# EAGLE design Pluvion 1 - Rev A (EAGLE 7.3.0)

## Sheet 1 of 3
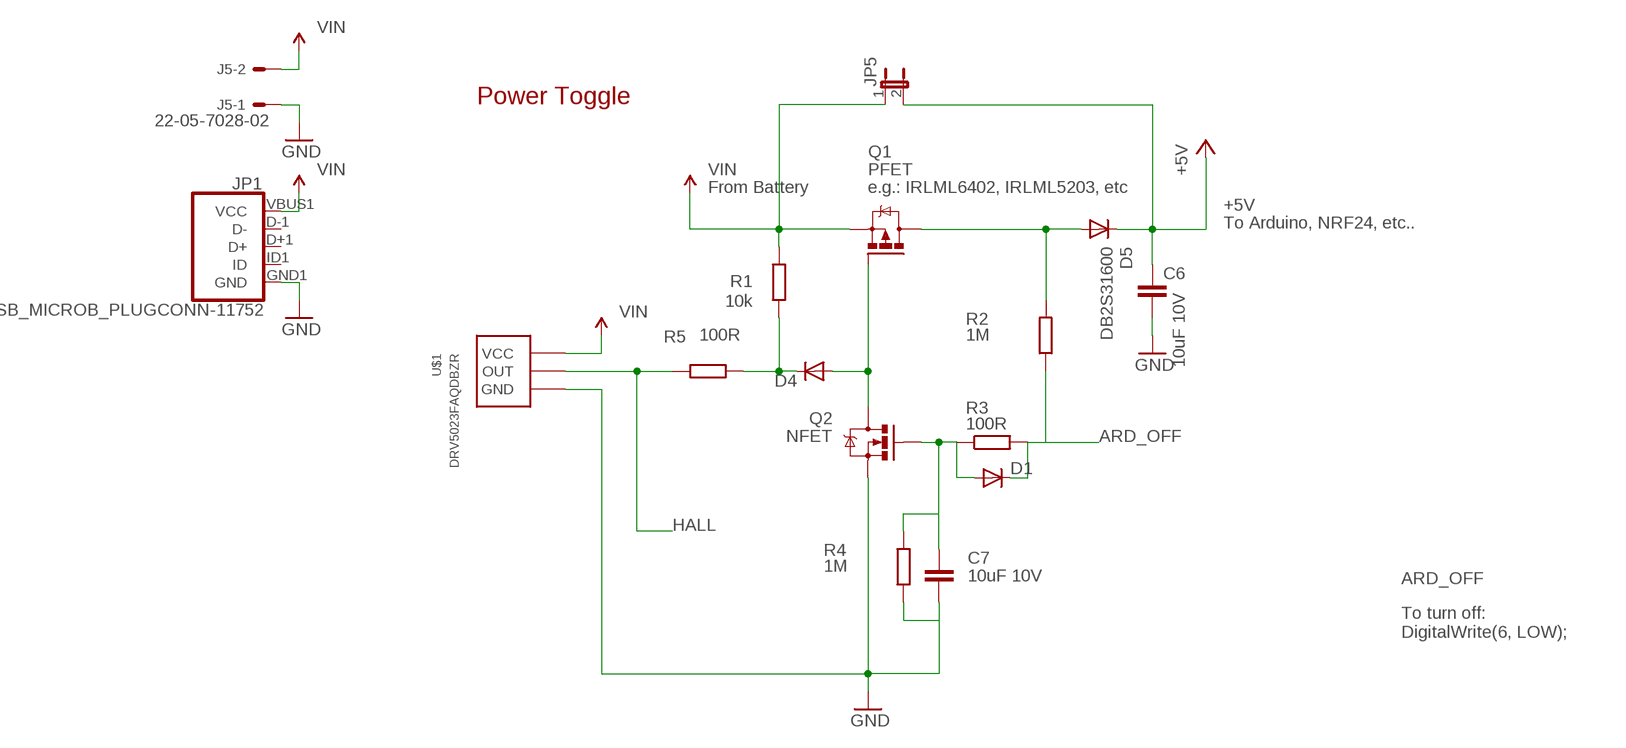
[diagram p0: schematic, sheet 1]

### Parts
C6  10uF 10V  C-EUC0805  [C0805]
C7  10uF 10V  C-EUC0805  [C0805]
D1  DIODESOD  [SOD-323]
D4  DIODESOD  [SOD-323]
D5  DB2S31600  DIODESMA  [SMA-DIODE]
J5  22-05-7028-02  [7395-02]
JP1  USB_MICROB_PLUGCONN-11752  [USB-B-MICRO-SMD_V03]
JP5  JUMPER-2PTH  [1X02]
Q1  PFET  IRLML5203  [MICRO3]
Q2  NFET  MOSFET-NCHANNELBSS123LT1G  [SOT23]
R1  10k  R-EU_R0805  [R0805]
R2  1M  R-EU_R0805  [R0805]
R3  100R  R-EU_R0805  [R0805]
R4  1M  R-EU_R0805  [R0805]
R5  100R  R-EU_R0805  [R0805]
U$1  DRV5023FAQDBZR  [SOT23]

### Nets
+5V: C6.1 D5.C JP5.2 ; also sheet 2
ARD_OFF: D1.1(C) R2.1 R3.2
BUTTONS: D4.2(A) Q1.1(G) Q2.3(D)
GND: C6.2 C7.2 J5.1 JP1.GND1(GND) Q2.2(S) R4.1 U$1.3(GND) ; also sheet 2,3
HALL: R5.2 U$1.2(OUT) ; also sheet 3
N$1: D5.A Q1.3(D) R2.2
N$2: C7.1 D1.2(A) Q2.1(G) R3.1 R4.2
N$8: D4.1(C) R1.1 R5.1
VIN: J5.2 JP1.VBUS1(VCC) JP5.1 Q1.2(S) R1.2 U$1.1(VCC)
Unconnected: JP1.D+1(D+) JP1.D-1(D-) JP1.ID1(ID)

### Notes on the sheet
- Power Toggle
- From Battery | e.g.: IRLML6402, IRLML5203, etc
- To Arduino, NRF24, etc..
- To turn off:
  DigitalWrite(6, LOW);

## Sheet 2 of 3
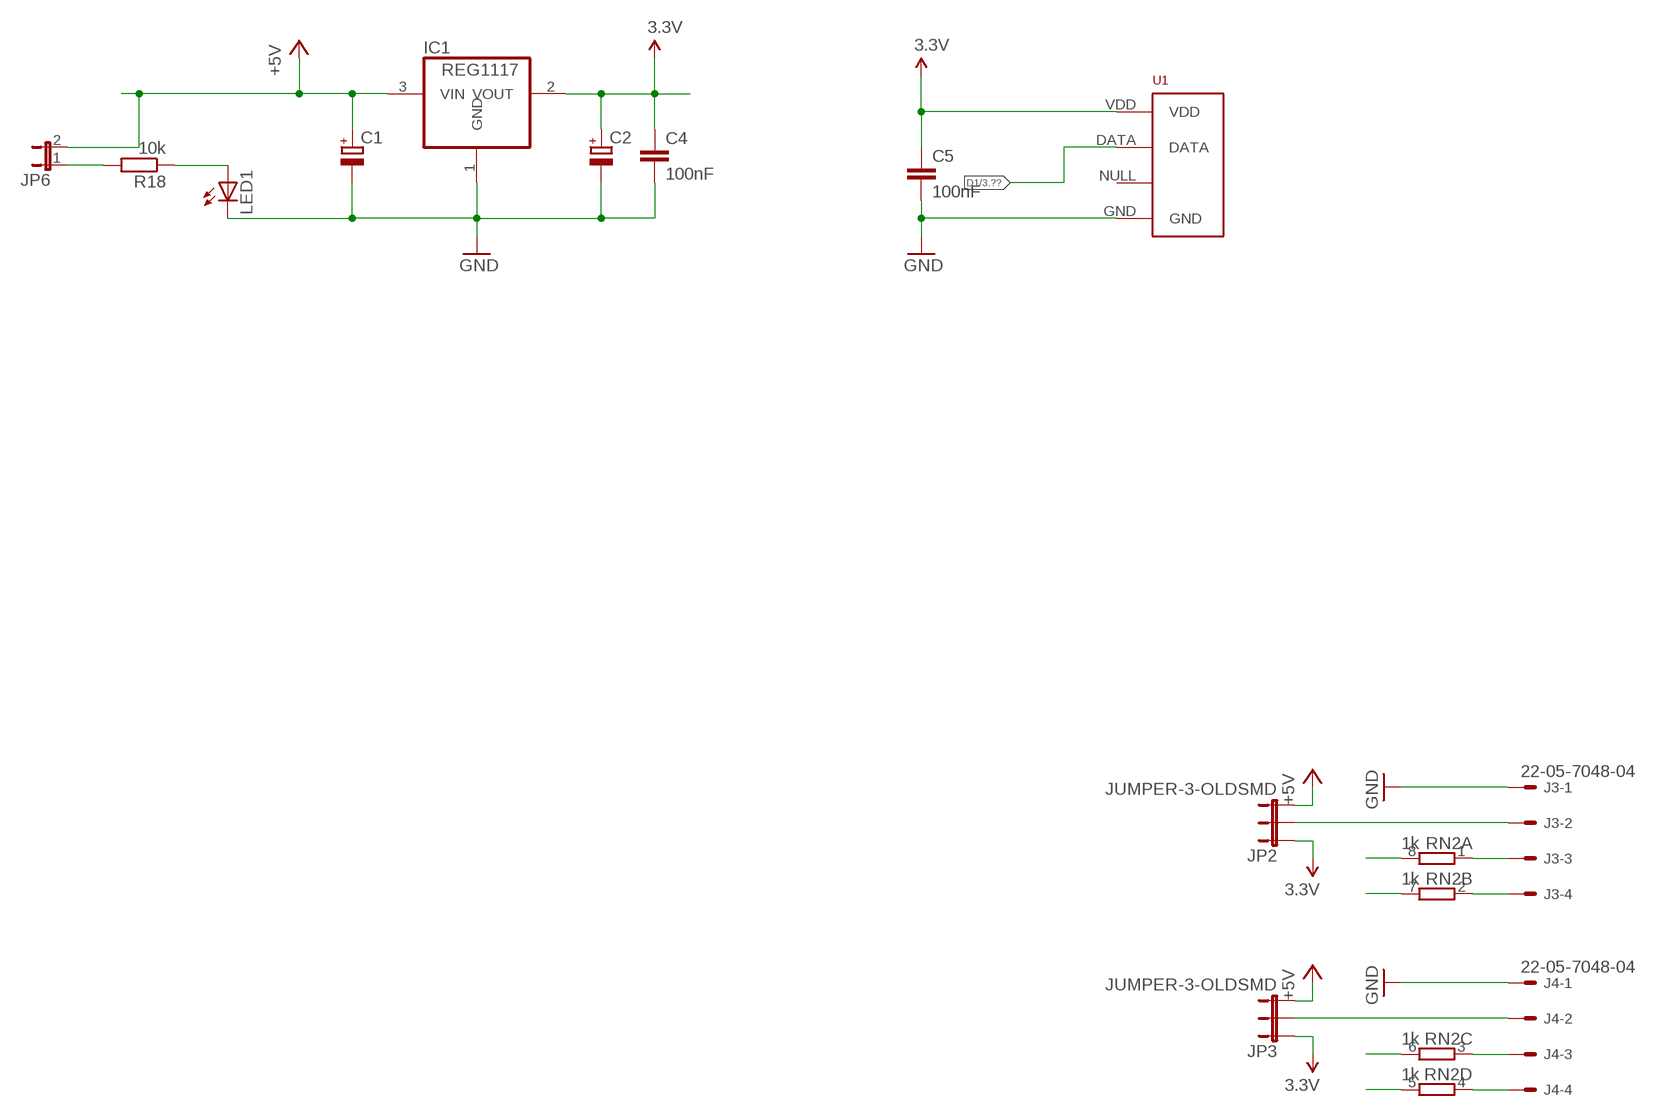
[diagram p1: schematic, sheet 2]

### Parts
C1  CPOL-EUC  [PANASONIC_C]
C2  CPOL-EUC  [PANASONIC_C]
C4  100nF  C-EUC0805  [C0805]
C5  100nF  C-EUC0805  [C0805]
IC1  REG1117  [SOT223]
J3  22-05-7048-04  [7395-04]
J4  22-05-7048-04  [7395-04]
JP2  JUMPER-3-OLDSMD  [SJ_3]
JP3  JUMPER-3-OLDSMD  [SJ_3]
JP6  JUMPER-2SMD-NO  [SJ_2S-NO]
LED1  LED1206  [LED-1206]
R18  10k  R-EU_R0805  [R0805]
RN2  1k  4R-N0603-ARV  [0603-ARV]
U1  RHT03_DHT-22_AM2302RA  [RHT03_DHT-22/RA]

### Nets
+3V3: C2.+ C4.1 C5.1 IC1.2(VOUT) JP2.1 JP3.1 U1.VDD ; supply symbol labelled 3.3V ; also sheet 3
+5V: C1.+ IC1.3(VIN) JP2.3 JP3.3 JP6.2 ; also sheet 1
D1: U1.DATA ; also sheet 3
GND: C1.- C2.- C4.2 C5.2 IC1.1(GND) J3.1 J4.1 LED1.C U1.GND ; also sheet 1,3
N$3: J3.3 RN2.1
N$4: J3.4 RN2.2
N$9: RN2.8
N$16: RN2.7
N$17: J4.3 RN2.3
N$18: J3.2 JP2.2
N$19: J4.4 RN2.4
N$20: J4.2 JP3.2
N$21: RN2.6
N$22: RN2.5
N$33: LED1.A R18.1
N$34: JP6.1 R18.2
Unconnected: U1.NULL

## Sheet 3 of 3
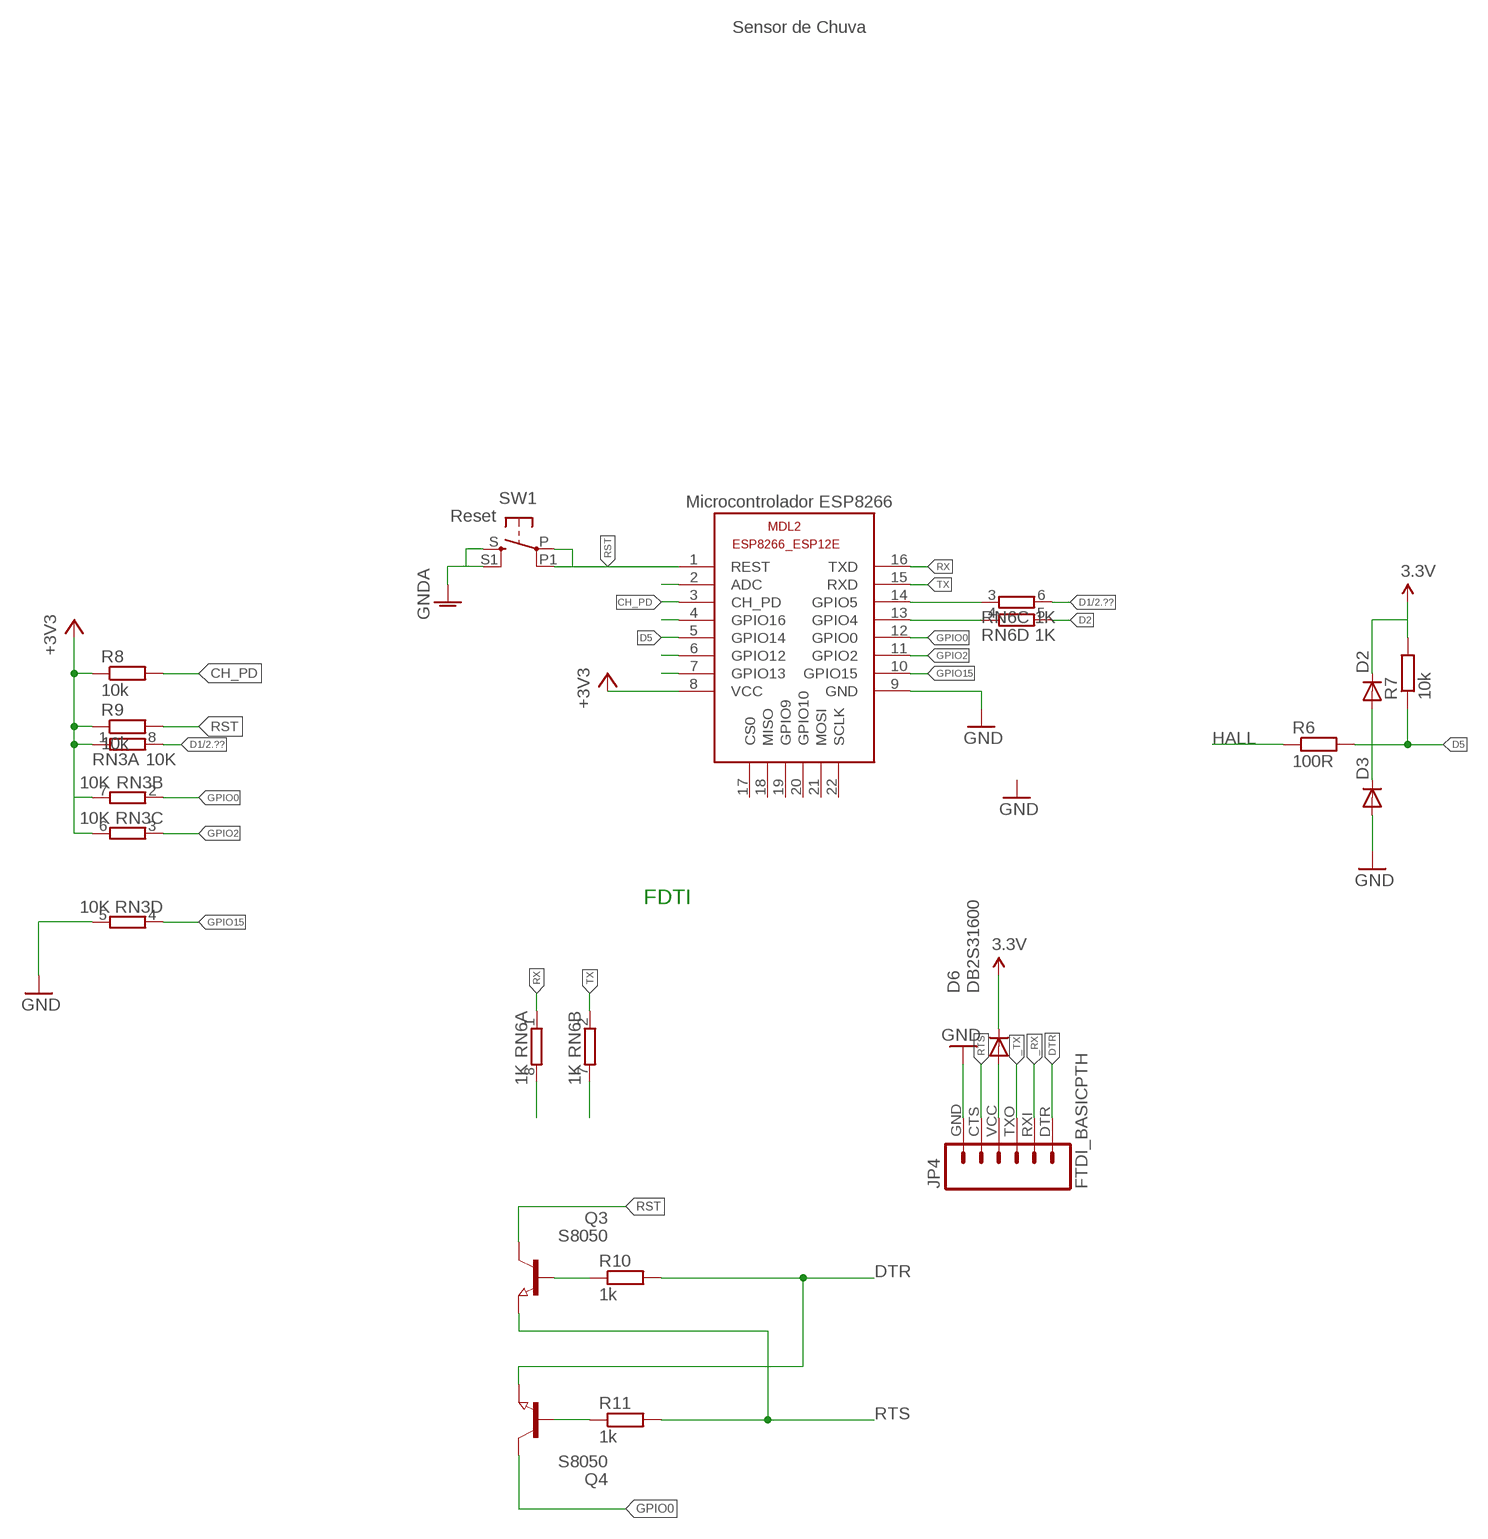
[diagram p2: schematic, sheet 3]

### Parts
D2  DIODESOD  [SOD-323]
D3  DIODESOD  [SOD-323]
D6  DB2S31600  DIODESMA  [SMA-DIODE]
JP4  FTDI_BASICPTH  [FTDI_BASIC]
MDL2  ESP8266-12EESP8266-ESP12E  [ESP8266-ESP12E]
Q3  S8050  NPN-TRANSISTOR_SOT23  [SOT23]
Q4  S8050  NPN-TRANSISTOR_SOT23  [SOT23]
R6  100R  R-EU_R0805  [R0805]
R7  10k  R-EU_R0805  [R0805]
R8  10k  R-EU_R0805  [R0805]
R9  10k  R-EU_R0805  [R0805]
R10  1k  R-EU_R0805  [R0805]
R11  1k  R-EU_R0805  [R0805]
RN3  10K  4R-N0603-ARV  [0603-ARV]
RN6  1K  4R-N0603-ARV  [0603-ARV]
SW1  Reset  10-XX-4.5SMD  [BT4.5X4.5]

### Nets
+3V3: D2.1(C) D6.C MDL2.8(VCC) R7.2 R8.1 R9.1 RN3.1 RN3.6 RN3.7 ; supply symbol labelled 3.3V ; also sheet 2
_RX: JP4.RXI RN6.8
_TX: JP4.TXO RN6.7
CH_PD: MDL2.3(CH_PD) R8.2
D1: RN3.8 RN6.6 ; also sheet 2
D2: RN6.5
D5: D2.2(A) D3.1(C) MDL2.5(GPIO14) R6.2 R7.1
DTR: JP4.DTR Q4.2(E) R10.2
GND: D3.2(A) JP4.GND MDL2.9(GND) RN3.5 SW1.S SW1.S1 ; supply symbol labelled GNDA ; also sheet 1,2
GPIO0: MDL2.12(GPIO0) Q4.3(C) RN3.2
GPIO2: MDL2.11(GPIO2) RN3.3
GPIO15: MDL2.10(GPIO15) RN3.4
HALL: R6.1 ; also sheet 1
N$6: Q3.1(B) R10.1
N$7: Q4.1(B) R11.1
N$10: MDL2.7(GPIO13)
N$11: MDL2.4(GPIO16)
N$12: MDL2.6(GPIO12)
N$14: MDL2.2(ADC)
N$25: MDL2.14(GPIO5) RN6.3
N$27: D6.A JP4.VCC
N$30: MDL2.13(GPIO4) RN6.4
RST: MDL2.1(REST) Q3.3(C) R9.2 SW1.P SW1.P1
RTS: JP4.CTS Q3.2(E) R11.2
RX: MDL2.16(TXD) RN6.1
TX: MDL2.15(RXD) RN6.2
Unconnected: MDL2.17(CS0) MDL2.18(MISO) MDL2.19(GPIO9) MDL2.20(GPIO10) MDL2.21(MOSI) MDL2.22(SCLK)

### Notes on the sheet
- Sensor de Chuva
- Microcontrolador ESP8266
- FDTI

## Library data of the parts
C1 C2 = wes:CPOL-EU: POLARIZED CAPACITOR, European symbol
C4-C7 = wes:C-EU: CAPACITOR, European symbol
D1-D4 = SparkFun-DiscreteSemi:DIODE: Diode These are standard reverse protection diodes and small signal diodes. SMA package can handle up to about 1A. SOD-323 can handle about 200mA. What the SOD-323 package when ordering, there are some mfgs out there that are 5-pin packages.; PROD_ID: DIO-09646
D5 D6 = SparkFun-DiscreteSemi:DIODE: Diode These are standard reverse protection diodes and small signal diodes. SMA package can handle up to about 1A. SOD-323 can handle about 200mA. What the SOD-323 package when ordering, there are some mfgs out there that are 5-pin packages.
IC1 = burr-brown:REG1117: 800mA and 1A Low Dropout (LDO) Positive Regulator 1.8V, 2.5V, 2.85V, 3.3V, 5V, and Adj; MPN: REG1117; OC_FARNELL: 1097566; OC_NEWARK: 14P6981
J3 J4 = con-molex:22-?-04: CONNECTOR wire to board 2.54 mm (.1 inch) pitch header; OC_FARNELL: unknown; OC_NEWARK: unknown
J5 = con-molex:22-?-02: CONNECTOR wire to board 2.54 mm (.1 inch) pitch header; OC_FARNELL: 9731601; OC_NEWARK: unknown
JP1 = SparkFun-Connectors:USB_MICROB_PLUG: USB Micro-B Plug Comes in a variety of packages. Check out Hirose's ZX-x0 line: http://www.hirose.co.jp/cataloge_hp/e24200011.pdf; PROD_ID: CONN-11752
JP2 JP3 = SparkFun-Passives:JUMPER-3-OLD
JP4 = SparkFun-Connectors:FTDI_BASIC: FTDI Basic header with labels
JP5 JP6 = SparkFun-Passives:JUMPER-2: Jumper Basic 0.1" spaced jumper. Use with breakaway headers.
LED1 = SparkFun-LED:LED: LEDs Standard schematic elements and footprints for 5mm, 3mm, 1206, and 0603 sized LEDs. 5mm - Spark Fun Electronics SKU : COM-00529 (and others)
MDL2 = ESP8266-ESP12E:ESP8266-12E: ESP8266-12E with additional I/O and GPIO04/05 corrected The author cannot warrant that this library is free from error or will meet your specific requirements. Created by PuceBaboon.com. Komagane, Nagano, JAPAN
Q1 = transistor-power:IRLML5203: HEXFET P-Channel Power MOSFET
Q2 = SparkFun-DiscreteSemi:MOSFET-NCHANNEL: Common NMOSFET Parts MFG P/N Store ID Prod ID FDD8780 TRANS-09984 SI7820DN TRANS-11055 FDS6630A IC-08089 2N7002PW TRANS-11151 FQP30N06L COM-10213 TRANS-10060 BSS123LT1G TRANS-08345 BSS138 TRANS-00830 BS170 2N7000; PROD_ID: TRANS-08345
Q3 Q4 = semicon-smd-ipc:NPN-TRANSISTOR_: NPN TRANSISTOR
R1-R11 R18 = wes:R-EU_: RESISTOR, European symbol
RN2 RN3 RN6 = resistor-dil:4R-N: Array Chip Resistor Source: RS Component / Phycomp; OC_FARNELL: unknown; OC_NEWARK: unknown
SW1 = buttons:10-XX: OMRON SWITCH
U1 = RHT03_DHT-22_AM2302:RHT03_DHT-22_AM2302: RHT03 / DHT-22 / AM2302 Packages and symbol for the RHT03 / DHT-22 relative humidity and temperature sensor. Note: The AM2302 is a wired version of the DHT-22 which typically requires less clearance and is thus provided as a separate package.; PROD_ID: SEN-10167
U$1 = lib_pluvion:DRV5023FAQDBZR: Digital Switch Hall Sensor

## Board
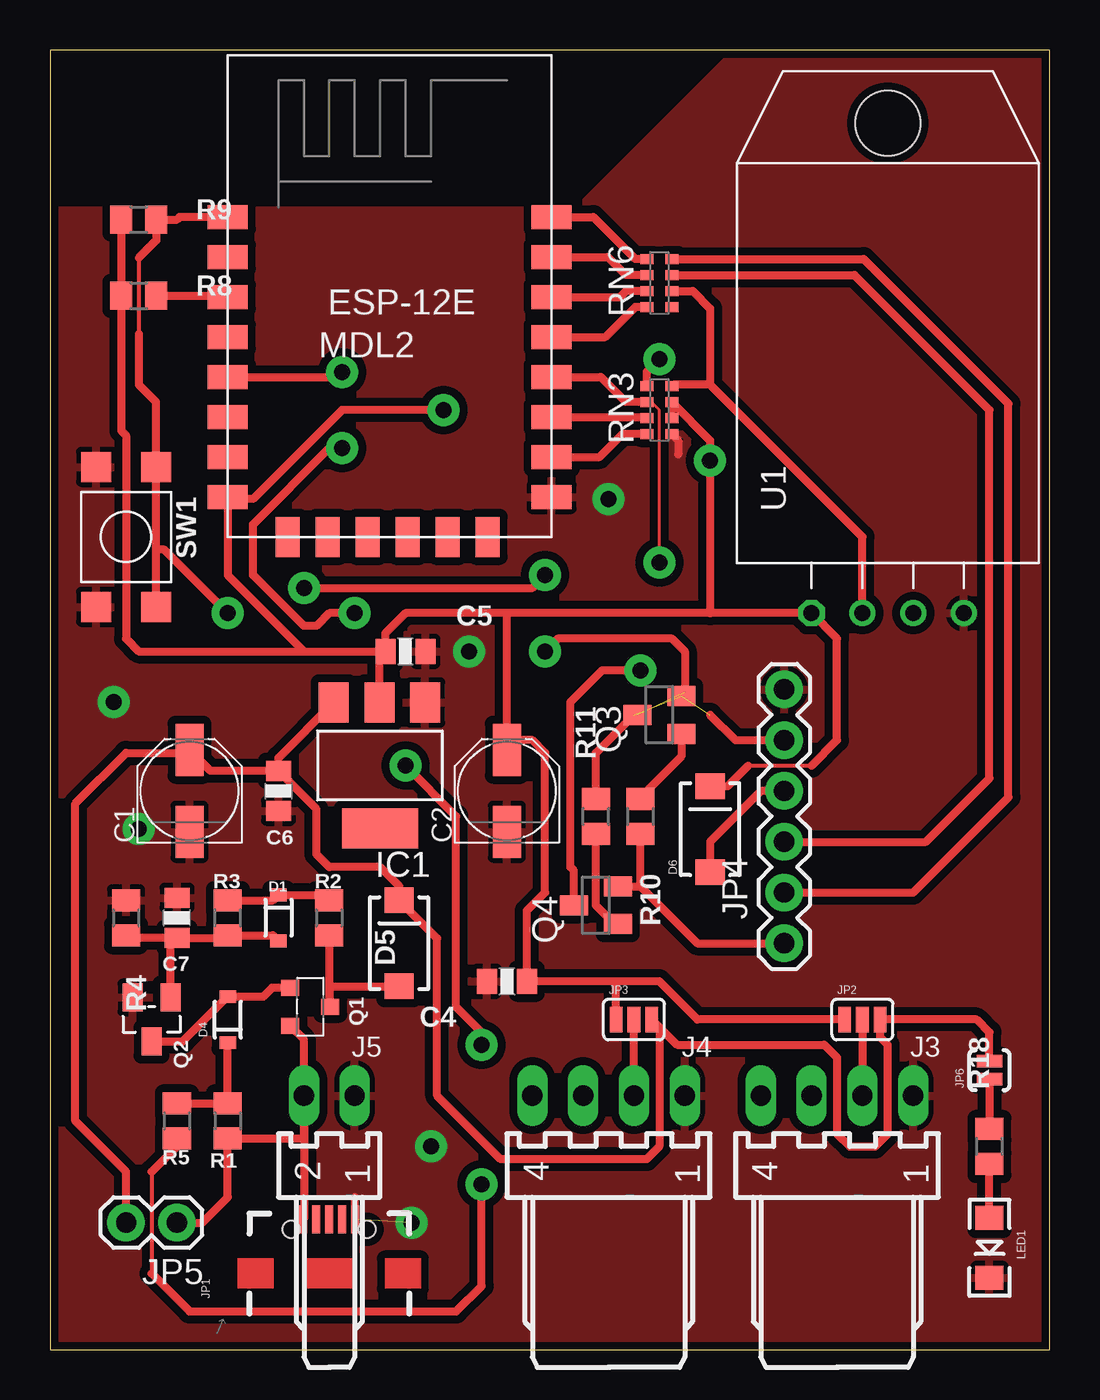
[diagram p3: board, top side]
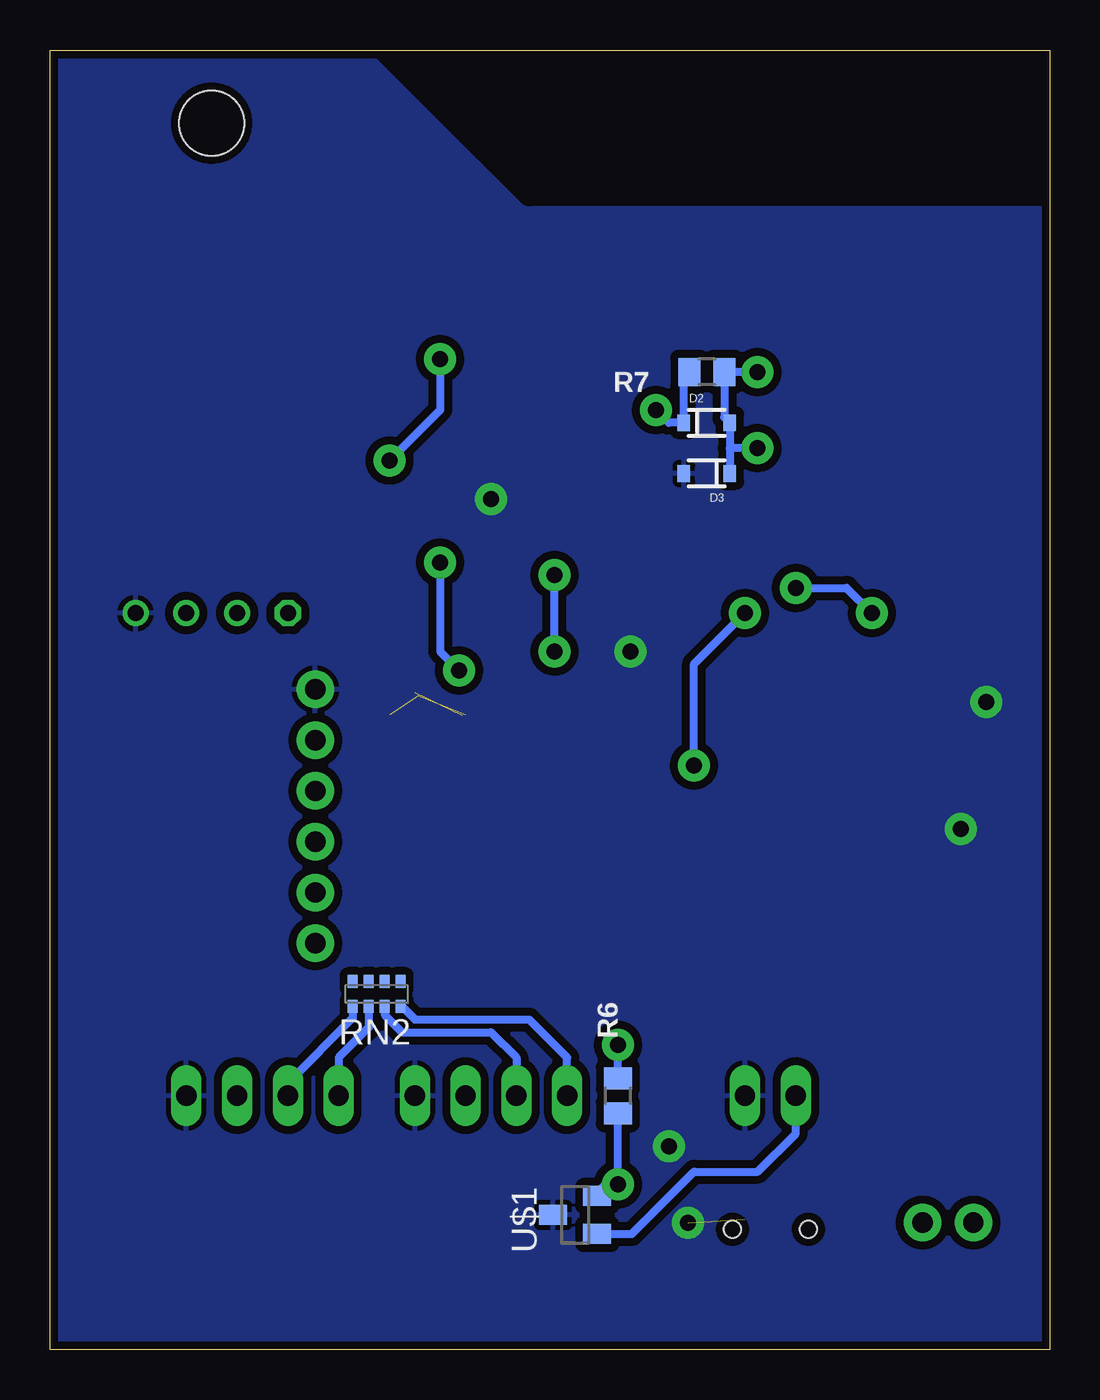
[diagram p4: board, bottom side, seen from below]

Size 50 x 65 mm. Coordinates in mm from the lower left corner, seen from the top.
Outline: 0,0 50,0 50,65 0,65 0,0
Copper layers (1*16): Top 0.035mm / dielectric 1.5mm / Bottom 0.035mm
Design rules "default *": minimum track width 10mil, minimum drill 0.6mm, track to track 8mil, track to pad 8mil, pad to pad 8mil, via to via 8mil, smd to smd 8mil, copper to edge 10mil, drill to drill 8mil, minimum pad ring 10mil, minimum via ring 8mil, stop-mask expansion 4mil, vias tented up to drill 0mil, thermal gap 10mil
tRestrict: area -1.3,57.8 to 34.3,66
bRestrict: area -1.3,57.8 to 34.3,66

### Footprints (pad centres in the part's own frame; a part is rotated, then mirrored left to right if it is on the bottom)
PANASONIC_C = smd 2.6 x 1.4: + 2.05,0; - -2.05,0
C0805 = smd 1 x 1.25: 1 -1,0; 2 1,0
SOD-323 = smd 0.63 x 0.83: 1 -1.15,0; 2 1.15,0
SMA-DIODE = smd 1.27 x 1.47: A -2.15,0; C 2.15,0
SOT223 = smd 1.499 x 2.007: 1 -2.261,-3.15; 2 0.025,-3.15; 3 2.311,-3.15 | smd 3.81 x 2.007: 4 0,3.15
7395-04 = drill 1.016 long: 1 3.81,0; 2 1.27,0; 3 -1.27,0; 4 -3.81,0
7395-02 = drill 1.016 long: 1 1.27,0; 2 -1.27,0
USB-B-MICRO-SMD_V03 = smd 1.4 x 0.4: D+1 2.7,0; D-1 2.7,0.65; GND1 2.7,-1.3; ID1 2.7,-0.65; VBUS1 2.7,1.3 | hole 0.85: 2.2,1.9; 2.2,-1.9
SJ_3 = smd 0.635 x 1.27: 1 -0.889,0; 2 0,0; 3 0.889,0
FTDI_BASIC = drill 1.016 pad 1.88: CTS 10.16,0; DTR 0,0; GND 12.7,0; RXI 2.54,0; TXO 5.08,0; VCC 7.62,0
1X02 = drill 1.016 pad 1.88: 1 0,0; 2 2.54,0
SJ_2S-NO = smd 0.635 x 1.27: 1 -0.45,0; 2 0.45,0
LED-1206 = smd 1.2 x 1.4: A -1.5,0; C 1.5,0
ESP8266-ESP12E = smd 2 x 1.2: 1 -7.62,5.84; 2 -7.62,3.84; 3 -7.62,1.84; 4 -7.62,-0.16; 5 -7.62,-2.16; 6 -7.62,-4.16; 7 -7.62,-6.16; 8 -7.62,-8.16; 9 8.58,-8.16; 10 8.58,-6.16; 11 8.58,-4.16; 12 8.58,-2.16; 13 8.58,-0.16; 14 8.58,1.84; 15 8.58,3.84; 16 8.58,5.84 | smd 1.2 x 2: 17 -4.62,-10.16; 18 -2.62,-10.16; 19 -0.62,-10.16; 20 1.38,-10.16; 21 3.38,-10.16; 22 5.38,-10.16
MICRO3 = smd 0.8 x 0.9: 1 -0.95,-1; 2 0.95,-1; 3 0,1
SOT23 = smd 1 x 1.4: 1 -0.95,-1.1; 2 0.95,-1.1; 3 0,1.1
R0805 = smd 1.1 x 1.4: 1 -0.875,0; 2 0.875,0
0603-ARV = smd 0.5 x 0.65: 1 -1.2,-0.625; 2 -0.4,-0.625; 3 0.4,-0.625; 4 1.2,-0.625; 5 1.2,0.625; 6 0.4,0.625; 7 -0.4,0.625; 8 -1.2,0.625
BT4.5X4.5 = smd 1.5 x 1.5: P -3.5,1.5; P1 3.5,1.5; S -3.5,-1.5; S1 3.5,-1.5
RHT03_DHT-22/RA = drill 0.8: DATA -1.27,0; GND 3.81,0; NULL 1.27,0 | drill 0.8 octagon: VDD -3.81,0 | hole 3.25: 0,24.5

### Placement (x,y rotation side)
C1  6.99,27.94 90 top
C2  22.86,27.94 90 top
C4  22.86,18.41 180 top
C5  17.78,34.92 0 top
C6  11.43,27.94 270 top
C7  6.35,21.59 90 top
D1  11.43,21.59 270 top
D2  17.14,46.35 0 bottom
D3  17.14,43.81 180 bottom
D4  8.89,16.51 90 top
D5  17.46,20.32 90 top
D6  33.02,26.04 90 top
IC1  16.51,29.21 180 top
J3  39.37,12.7 0 top
J4  27.94,12.7 0 top
J5  13.97,12.7 0 top
JP1  13.97,3.81 90 top
JP2  40.64,16.51 0 top
JP3  29.21,16.51 0 top
JP4  36.73,20.32 90 top
JP5  6.35,6.35 180 top
JP6  46.99,13.97 90 top
LED1  46.99,5.08 270 top
MDL2  16.51,50.8 0 top
Q1  13.02,17.14 270 top
Q2  5.08,16.51 180 top
Q3  30.48,31.75 90 top
Q4  27.3,22.23 90 top
R1  8.89,11.43 270 top
R2  13.97,21.59 270 top
R3  8.89,21.59 90 top
R4  3.81,21.59 270 top
R5  6.35,11.43 270 top
R6  21.59,12.7 90 bottom
R7  17.14,48.9 180 bottom
R8  4.45,52.7 0 top
R9  4.45,56.52 0 top
R10  29.53,26.67 270 top
R11  27.3,26.67 90 top
R18  46.99,10.16 90 top
RN2  33.66,17.78 0 bottom
RN3  30.48,46.99 270 top
RN6  30.48,53.34 270 top
SW1  3.81,40.64 270 top
U1  41.91,36.83 0 top
U$1  23.73,6.73 90 bottom

### Tracks (layer width: path | path; a pad name or v marks a point on that pad's centre or on a via)
+3V3  (via drill 0.8 pad 1.6)
  Top 0.203: 34.92,29.21 38.1,29.21
  Top 0.406: RN3.6 RN3.7 33.02,45.48 v33.02,44.45 33.02,36.83 | IC1.2 16.48,34.63 C5.1 | C5.1 16.78,35.83 17.78,36.83 22.86,36.83 | 12.7,34.92 8.89,38.73 MDL2.8 8.98,42.55 10.16,42.55 14.61,46.99 v19.68,46.99 | 12.7,34.92 C5.1 | 33.02,36.83 U1.VDD 39.37,35.56 39.37,30.48 38.1,29.21 | 33.02,36.83 22.86,36.83 | 22.86,36.83 C2.+ 23,30.48 24.13,30.48 24.77,29.84 24.77,22.86 23.86,21.95 C4.1 28.32,18.41 | RN3.1 29.86,48.91 v30.48,49.53 | JP2.1 32.38,16.51 30.48,18.41 28.32,18.41 | JP3.1 28.32,18.41 | D6.C 33.9,28.18 34.92,29.21 | R9.1 R8.1 3.57,45.96 3.81,45.72 3.81,35.56 4.45,34.92 12.7,34.92
  Bottom 0.406: v30.48,49.53 30.48,46.99 v33.02,44.45 | R7.2 18.3,48.62 D2.1 19.05,46.35 v19.68,46.99
+5V
  Top 0.406: JP5.2 3.81,8.89 1.27,11.43 1.27,27.3 3.81,29.84 6.84,29.84 C1.+ 8.04,28.94 C6.1 | C6.1 11.43,29.59 IC1.3 | C6.1 13.34,27.04 13.34,24.77 13.97,24.13 16.51,24.13 17.46,23.18 D5.C 19.37,20.57 19.37,12.7 22.54,9.53 29.84,9.53 30.48,10.16 30.48,16.13 JP3.3 31.37,15.24 38.73,15.24 39.37,14.61 39.37,10.79 40.01,10.16 41.27,10.16 41.91,10.79 41.91,15.24 41.53,15.62 JP2.3 46.35,16.51 46.99,15.88 JP6.2
_RX
  Top 0.406: JP4.RXI 43.18,22.86 47.94,27.62 47.94,47.31 40.71,54.54 RN6.8
_TX
  Top 0.406: JP4.TXO 43.81,25.4 46.99,28.57 46.99,46.99 40.24,53.74 RN6.7
ARD_OFF
  Top 0.406: R3.2 11.15,22.46 D1.1 13.7,22.74 R2.1
BUTTONS
  Top 0.406: Q2.3 6.64,15.41 D4.2 10.68,17.66 11.11,18.09 Q1.1
CH_PD
  Top 0.406: R8.2 8.82,52.7 MDL2.3
D1
  Top 0.406: U1.DATA 40.64,40.64 33.02,48.26 | RN6.6 32.15,52.94 33.02,52.07 33.02,48.26 | 33.02,48.26 31.18,48.26 RN3.8
D5  (via drill 0.8 pad 1.6)
  Top 0.406: MDL2.5 14.35,48.64 v14.61,48.9 | v21.59,15.24 21.59,15.88 20.32,17.14 20.32,26.67 v17.78,29.21 | v15.24,36.83 13.97,36.83 13.34,36.2 12.7,36.2 10.16,38.73 10.16,41.27 13.97,45.09 v14.61,45.09
  Bottom 0.406: v14.61,48.9 R7.1 16.27,46.63 D2.2 15.99,45.09 | 15.99,45.09 D3.1 | R6.2 v21.59,15.24 | v17.78,29.21 17.78,34.29 v15.24,36.83 | v14.61,45.09 15.99,45.09
DTR
  Top 0.406: Q4.2 29.53,23.18 | 29.53,23.18 32.38,20.32 JP4.DTR | 29.53,23.18 29.53,24.13 R10.2
GND  (via drill 0.8 pad 1.6)  (1 unrouted)
  Top 0.406: JP1.GND1 15.27,7.59 15.24,7.62 | RN3.5 31.43,45.46 31.43,44.77
  other vias: 19.05,10.16 18.1,6.35 20.95,34.92 27.94,42.55 4.45,26.04 3.17,32.38
  pour Top (isolate 0.4): 0,90.17 52.07,90.17 52.07,-8.89 0,-8.89
  pour Bottom (isolate 0.4): -12.06,85.09 -12.06,-9.53 53.98,-9.53 53.98,85.09 -11.43,85.09
GPIO0  (via drill 0.8 pad 1.6)
  Top 0.152: v30.48,39.37 30.48,46.99 30.08,47.39 RN3.2
  Top 0.406: RN3.2 28.81,47.39 27.56,48.64 MDL2.12 | Q4.3 26.2,23.96 26.04,24.13 26.04,32.38 27.62,33.97 v29.53,33.97
  Bottom 0.406: v30.48,39.37 30.48,34.92 v29.53,33.97
GPIO2
  Top 0.406: MDL2.11 29.8,46.64 RN3.3
GPIO15
  Top 0.406: RN3.4 28.64,45.79 27.5,44.64 MDL2.10
HALL  (via drill 0.8 pad 1.6)
  Top 0.203: 5.08,8.89 5.08,3.81
  Top 0.406: R5.2 6.35,10.16 5.08,8.89 | 5.08,3.81 6.99,1.91 20.32,1.91 21.59,3.17 v21.59,8.26
  Bottom 0.406: R6.1 21.59,8.89 22.63,7.85 U$1.2 22.16,7.68 v21.59,8.26
N$1
  Top 0.406: R2.2 13.97,17.19 Q1.3 14.02,18.17 D5.A
N$2
  Top 0.406: Q2.1 6.03,20.27 C7.1 | C7.1 3.94,20.59 R4.2 | C7.1 8.77,20.59 R3.1 11.15,20.71 D1.2
N$3
  Bottom 0.406: RN2.1 34.85,16.58 38.1,13.34 J3.3
N$4
  Bottom 0.406: RN2.2 34.05,16.11 35.56,14.61 J3.4
N$6
  Top 0.406: Q3.1 31.58,29.68 29.53,27.62 R10.1
N$7
  Top 0.406: Q4.1 28.25,21.27 27.3,22.23 R11.1
N$8
  Top 0.406: R5.1 R1.1 D4.1
N$17
  Bottom 0.406: RN2.3 33.26,16.75 32.38,15.88 27.94,15.88 26.67,14.61 J4.3
N$18
  Top 0.406: JP2.2 J3.2
N$19
  Bottom 0.406: J4.4 24.13,14.61 26.04,16.51 31.75,16.51 32.4,17.16 RN2.4
N$20
  Top 0.406: J4.2 JP3.2
N$25
  Top 0.406: RN6.3 28.81,52.94 28.51,52.64 MDL2.14
N$27
  Top 0.406: JP4.VCC 35.56,27.94 33.02,25.4 D6.A
N$30
  Top 0.406: MDL2.13 27.78,50.64 29.28,52.14 RN6.4
N$33
  Top 0.406: LED1.A R18.1
N$34
  Top 0.406: JP6.1 R18.2
RST  (via drill 0.8 pad 1.6)  (1 unrouted)
  Top 0.203: 4.45,54.61 4.45,50.8
  Top 0.406: v8.89,36.83 5.71,40.01 5.31,40.01 | 31.75,32.87 31.75,34.92 31.11,35.56 25.4,35.56 v24.77,34.92 | SW1.P1 5.31,40.01 | 5.31,40.01 SW1.P 5.31,47.4 4.45,48.26 4.45,50.8 | MDL2.1 6.47,56.64 6.35,56.52 R9.2 5.32,55.48 4.45,54.61 | v12.7,38.1 24.13,38.1 v24.77,38.73
  Bottom 0.406: v24.77,34.92 v24.77,38.73 | v12.7,38.1 10.16,38.1 v8.89,36.83
RTS  (2 unrouted)
  Top 0.406: R11.2 27.3,29.84 29.21,31.75 | 33.02,31.75 34.29,30.48 JP4.CTS
RX
  Top 0.406: RN6.1 29.28,54.54 27.18,56.64 MDL2.16
TX
  Top 0.406: RN6.2 28.81,53.74 27.91,54.64 MDL2.15
VIN
  Top 0.406: J5.2 12.7,15.51 Q1.2 | J5.2 12.7,6.54 JP1.VBUS1 | JP5.1 7.62,6.35 8.89,7.62 R1.2 12.7,10.55 J5.2
  Bottom 0.406: U$1.1 20.89,5.78 17.78,8.89 14.61,8.89 12.7,10.79 J5.2